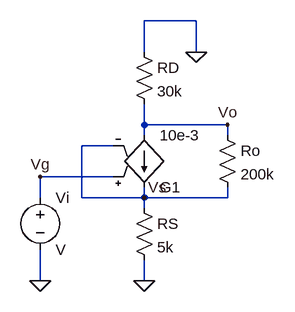
[diagram p0: schematic common_source.asc]
common_source.asc, the LTspice schematic file:
Version 4
SHEET 1 880 680
WIRE 224 -112 144 -112
WIRE 144 -64 144 -112
WIRE 224 -64 224 -112
WIRE 144 48 144 16
WIRE 272 48 144 48
WIRE 144 64 144 48
WIRE 272 64 272 48
WIRE 96 80 48 80
WIRE 96 128 -16 128
WIRE -16 160 -16 128
WIRE 48 160 48 80
WIRE 144 160 144 144
WIRE 144 160 48 160
WIRE 272 160 272 144
WIRE 272 160 144 160
WIRE 144 176 144 160
WIRE -16 288 -16 240
WIRE 144 288 144 256
FLAG 144 288 0
FLAG 224 -64 0
FLAG -16 288 0
FLAG 272 48 Vo
FLAG 144 160 Vs
FLAG -16 128 Vg
SYMBOL res 128 160 R0
SYMATTR InstName RS
SYMATTR Value 5k
SYMBOL res 128 -80 R0
SYMATTR InstName RD
SYMATTR Value 30k
SYMBOL res 256 48 R0
SYMATTR InstName Ro
SYMATTR Value 200k
SYMBOL g 144 160 M180
SYMATTR InstName G1
SYMATTR Value 10e-3
SYMBOL voltage -16 144 R0
SYMATTR InstName Vi

The netlist it stands for:
* common_source.asc
RS Vs 0 5k
RD 0 Vo 30k
Ro Vo Vs 200k
G1 Vo Vs Vg Vs 10e-3
Vi Vg 0 V
.backanno
.end